# EasyEDA Pro project 采样模块.eprj

# Schematic 原理图1
Board Name: 采样模块1; Create Date: 2025-12-25; Page Name: P1; Project Name: 采样模块; Schematic Name: 原理图1; Update Date: 2025-12-25; Company: 嘉立创EDA; Page Size: A4; Version: V1.0
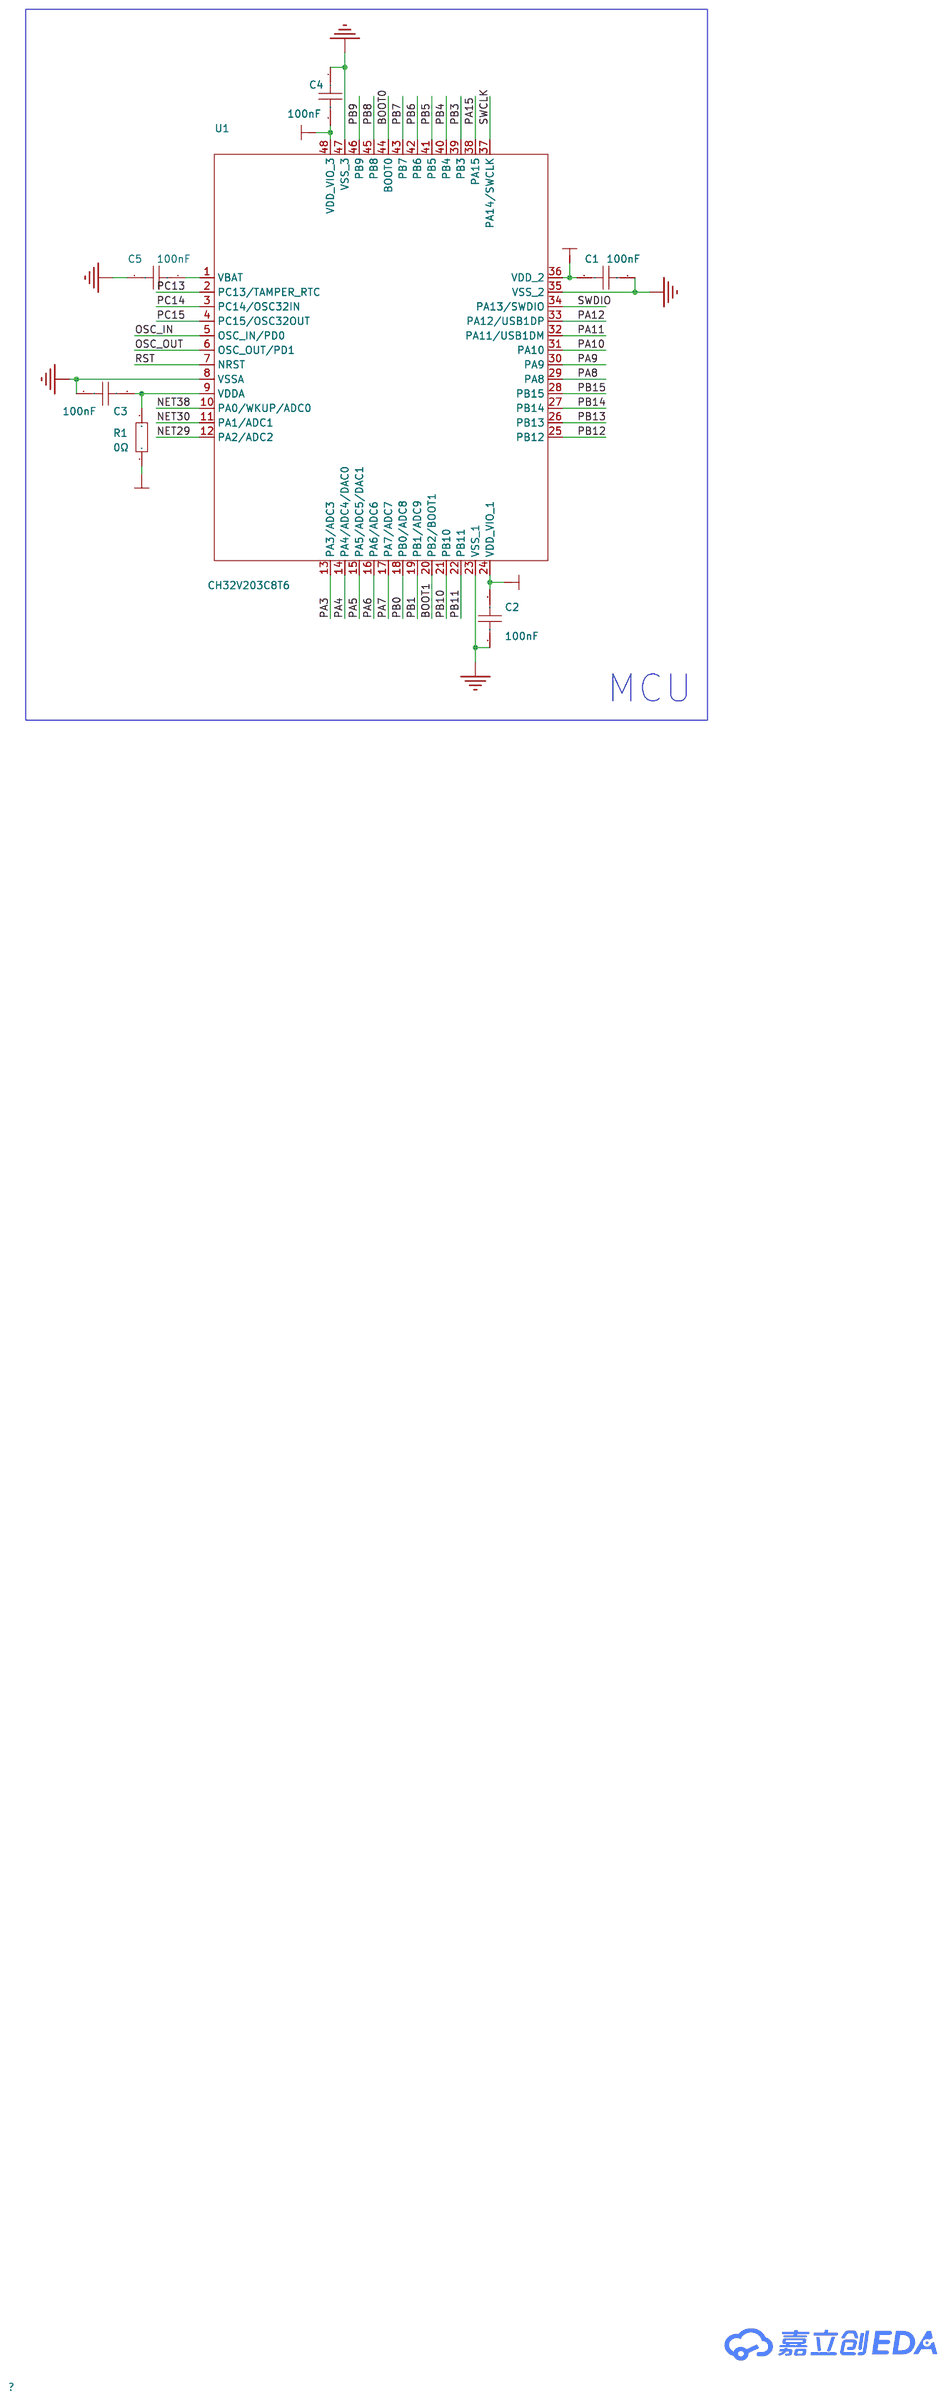
[diagram p0: schematic sheet]

## Parts
C1  100nF  [C0603]
C2  100nF  [C0603]
C3  100nF  [C0603]
C4  100nF  [C0603]
C5  100nF  [C0603]
R1  0Ω  [R0603]
U1  CH32V203C8T6  [LQFP-48_L7.0-W7.0-P0.50-LS9.0-BL]

## Library data of the parts
C1-C5 = CGA0603X7R104K500JT: LCSC Part Name: 100nF ±10% 50V; Supplier Part: C6119867; Manufacturer: HRE(芯声); Supplier Footprint: 0603; JLCPCB Part Class: 扩展库; Datasheet: https://item.szlcsc.com/datasheet/CGA0603X7R104K500JT/7062573.html; Supplier: LCSC; Tolerance: ±10%; Voltage Rating: 50V; Temperature Coefficient: X7R
R1 = 0603WAF0000T5E: LCSC Part Name: 0Ω ±1% 100mW 厚膜电阻; Supplier Part: C21189; Manufacturer: UNI-ROYAL(厚声); Supplier Footprint: 0603; JLCPCB Part Class: 基础库; Datasheet: https://item.szlcsc.com/datasheet/0603WAF0000T5E/21903.html; Supplier: LCSC; Type: 厚膜电阻; Tolerance: ±1%; Power(Watts): 100mW; Voltage-Supply(Max): 75V; Operating Temperature: -55℃~+155℃
U1 = CH32V203C8T6: Supplier Part: C3001172; Manufacturer: WCH(南京沁恒); Supplier Footprint: LQFP-48(7x7); JLCPCB Part Class: 扩展库; Datasheet: https://atta.szlcsc.com/upload/public/pdf/source/20220425/D3E728E801B9982E2758AC225E3A30F9.pdf; Supplier: LCSC; CPU Core: RISC-V; Program Storage Size: 64KB; RAM Size: 20KB; CPU Maximum Speed: 144MHz; Program Memory Type: FLASH

## Nets
3.3V: C1.1 C2.2 C4.2 R1.1 U1.24(VDD_VIO_1) U1.36(VDD_2) U1.48(VDD_VIO_3)
GND: C1.2 C2.1 C3.2 C4.1 C5.2 U1.8(VSSA) U1.23(VSS_1) U1.35(VSS_2) U1.47(VSS_3)
BOOT0: U1.44(BOOT0)
BOOT1: U1.20(PB2/BOOT1)
NET29: U1.12(PA2/ADC2)
NET30: U1.11(PA1/ADC1)
NET38: U1.10(PA0/WKUP/ADC0)
OSC_IN: U1.5(OSC_IN/PD0)
OSC_OUT: U1.6(OSC_OUT/PD1)
PA3: U1.13(PA3/ADC3)
PA4: U1.14(PA4/ADC4/DAC0)
PA5: U1.15(PA5/ADC5/DAC1)
PA6: U1.16(PA6/ADC6)
PA7: U1.17(PA7/ADC7)
PA8: U1.29(PA8)
PA9: U1.30(PA9)
PA10: U1.31(PA10)
PA11: U1.32(PA11/USB1DM)
PA12: U1.33(PA12/USB1DP)
PA15: U1.38(PA15)
PB0: U1.18(PB0/ADC8)
PB1: U1.19(PB1/ADC9)
PB3: U1.39(PB3)
PB4: U1.40(PB4)
PB5: U1.41(PB5)
PB6: U1.42(PB6)
PB7: U1.43(PB7)
PB8: U1.45(PB8)
PB9: U1.46(PB9)
PB10: U1.21(PB10)
PB11: U1.22(PB11)
PB12: U1.25(PB12)
PB13: U1.26(PB13)
PB14: U1.27(PB14)
PB15: U1.28(PB15)
PC13: U1.2(PC13/TAMPER_RTC)
PC14: U1.3(PC14/OSC32IN)
PC15: U1.4(PC15/OSC32OUT)
RST: U1.7(NRST)
SWCLK: U1.37(PA14/SWCLK)
SWDIO: U1.34(PA13/SWDIO)
Net-(C3-1): C3.1 R1.2 U1.9(VDDA)
Net-(C5-1): C5.1 U1.1(VBAT)

## Notes on the sheet
- MCU
